# EAGLE design InputChannel (EAGLE 7.3.0)
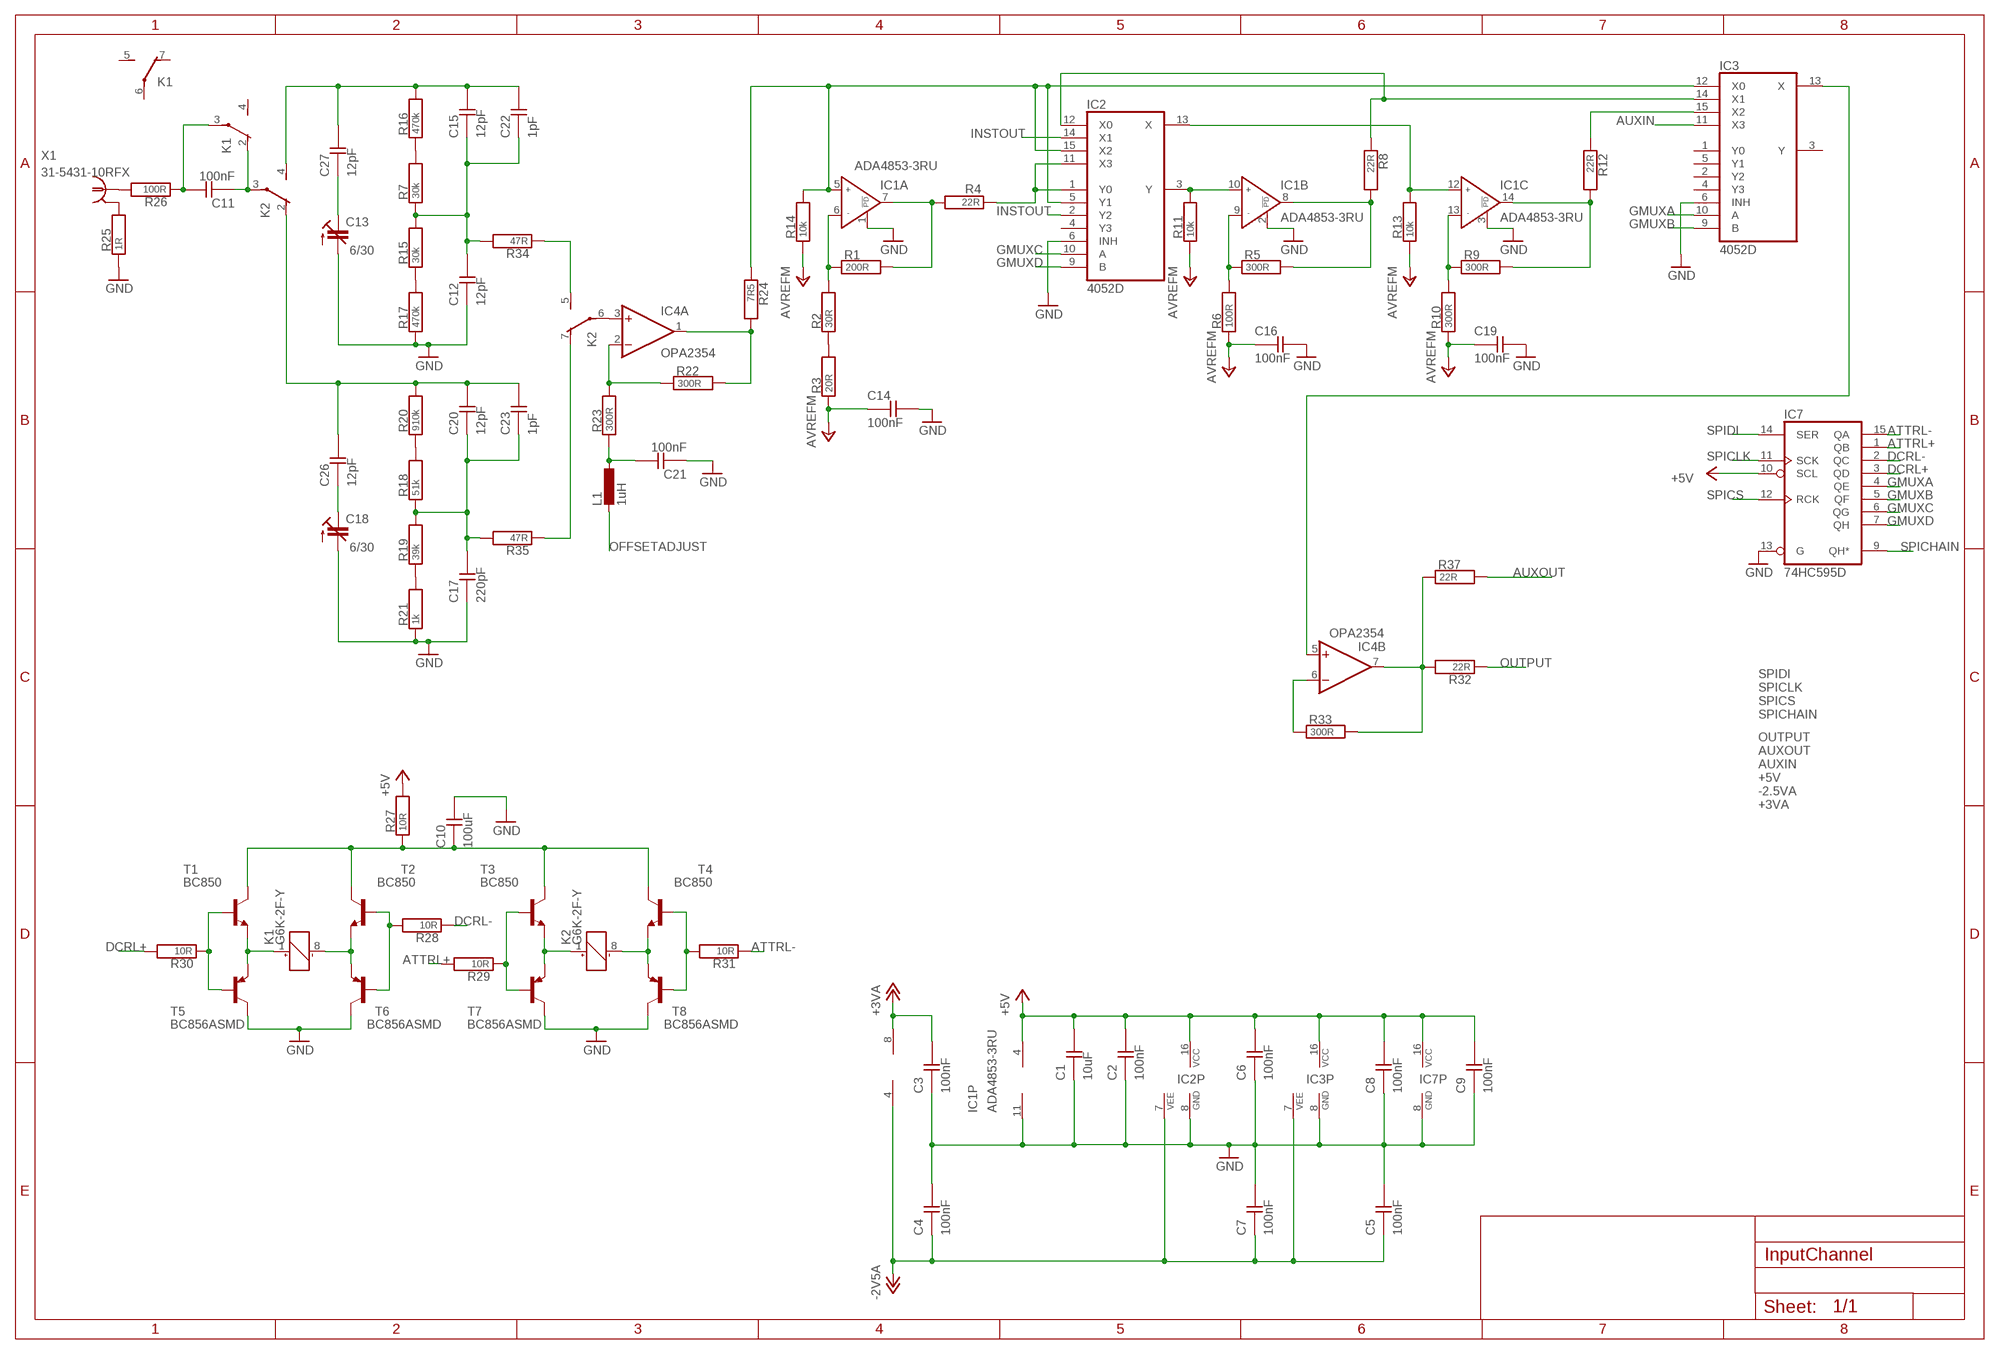
[diagram p0: schematic, sheet 1]

## Parts
C1  10uF  CAPC0603  [0603]
C2  100nF  CAPC0603  [0603]
C3  100nF  CAPC0603  [0603]
C4  100nF  CAPC0402  [0402]
C5  100nF  CAPC0603  [0603]
C6  100nF  CAPC0603  [0603]
C7  100nF  CAPC0603  [0603]
C8  100nF  CAPC0603  [0603]
C9  100nF  CAPC0603  [0603]
C10  100uF  CAPC1206  [1206]
C11  100nF  CAPC0603  [0603]
C12  12pF  CAPC0603  [0603]
C13  6/30  C-TRIMMTZBX4  [CTRIMTZBX4]
C14  100nF  CAPC0402  [0402]
C15  12pF  CAPC0603  [0603]
C16  100nF  CAPC0402  [0402]
C17  220pF  CAPC0603  [0603]
C18  6/30  C-TRIMMTZBX4  [CTRIMTZBX4]
C19  100nF  CAPC0402  [0402]
C20  12pF  CAPC0603  [0603]
C21  100nF  CAPC0402  [0402]
C22  1pF  CAPC0603  [0603]
C23  1pF  CAPC0603  [0603]
C26  12pF  CAPC0603  [0603]
C27  12pF  CAPC0603  [0603]
IC1  ADA4853-3RU  [SO14]
IC2  4052D  [SO16]
IC3  4052D  [SO16]
IC4  OPA2354  AD8682RM  [MSOP08]
IC7  74HC595D  [SO16]
K1  G6K-2F-Y  [G6K-2F-Y]
K2  G6K-2F-Y  [G6K-2F-Y]
L1  1uH  L-EUL3216C  [L3216C]
R1  200R  RESR0603  [0603]
R2  30R  RESR0603  [0603]
R3  20R  RESR0603  [0603]
R4  22R  RESR0603  [0603]
R5  300R  RESR0603  [0603]
R6  100R  RESR0603  [0603]
R7  30k  RESR0603  [0603]
R8  22R  RESR0603  [0603]
R9  300R  RESR0603  [0603]
R10  300R  RESR0603  [0603]
R11  10k  RESR0603  [0603]
R12  22R  RESR0603  [0603]
R13  10k  RESR0603  [0603]
R14  10k  RESR0603  [0603]
R15  30k  RESR0603  [0603]
R16  470k  RESR0603  [0603]
R17  470k  RESR0603  [0603]
R18  51k  RESR0603  [0603]
R19  39k  RESR0603  [0603]
R20  910k  RESR0603  [0603]
R21  1k  RESR0603  [0603]
R22  300R  RESR0603  [0603]
R23  300R  RESR0603  [0603]
R24  7R5  RESR0603  [0603]
R25  1R  RESR0603  [0603]
R26  100R  RESR0603  [0603]
R27  10R  RESR0603  [0603]
R28  10R  RESR0603  [0603]
R29  10R  RESR0603  [0603]
R30  10R  RESR0603  [0603]
R31  10R  RESR0603  [0603]
R32  22R  RESR0603  [0603]
R33  300R  RESR0603  [0603]
R34  47R  RESR0603  [0603]
R35  47R  RESR0603  [0603]
R37  22R  RESR0603  [0603]
T1  BC850  [SOT23]
T2  BC850  [SOT23]
T3  BC850  [SOT23]
T4  BC850  [SOT23]
T5  BC856ASMD  [SOT23-BEC]
T6  BC856ASMD  [SOT23-BEC]
T7  BC856ASMD  [SOT23-BEC]
T8  BC856ASMD  [SOT23-BEC]
X1  31-5431-10RFX  227161-8  [AMP_227161]

## Nets
+3VA: C3.2 IC4.8(P:V+)
+5V: C1.2 C2.2 C6.2 C8.2 C9.2 IC1.4(P:V+) IC2.16(VCC) IC3.16(VCC) IC7.10(SCL) IC7.16(VCC) R27.2
-2V5A: C4.1 C5.1 C7.1 IC2.7(VEE) IC3.7(VEE) IC4.4(P:V-)
ATTRL+: IC7.1(QB) R29.2
ATTRL-: IC7.15(QA) R31.1
AUXIN: IC3.11(X3)
AUXOUT: R37.2
AVREFM: C14.1 C16.1 C19.1 R3.1 R6.1 R10.1 R11.1 R13.1 R14.1
DCRL+: IC7.3(QD) R30.2
DCRL-: IC7.2(QC) R28.1
GMUXA: IC3.10(A) IC7.4(QE)
GMUXB: IC3.9(B) IC7.5(QF)
GMUXC: IC2.10(A) IC7.6(QG)
GMUXD: IC2.9(B) IC7.7(QH)
GND: C1.1 C2.1 C3.1 C4.2 C5.2 C6.1 C7.2 C8.1 C9.1 C10.2 C12.1 C13.2(A) C14.2 C16.2 C17.1 C18.2(A) C19.2 C21.1 IC1.1(A:!POWERDOWN) IC1.2(B:!POWERDOWN) IC1.3(C:!POWERDOWN) IC1.11(P:V-) IC2.6(INH) IC2.8(GND) IC3.6(INH) IC3.8(GND) IC7.8(GND) IC7.13(G) R17.1 R21.1 R25.1 T5.C T6.C T7.C T8.C
INSTOUT: IC2.2(Y2) IC2.14(X1)
N$1: IC1.6(A:IN-) R1.1 R2.2
N$2: IC1.7(A:OUT) R1.2 R4.2
N$3: R2.1 R3.2
N$4: C11.2 K1.3(2:P) R26.1
N$5: IC1.9(B:IN-) R5.1 R6.2
N$6: IC2.1(Y0) IC2.11(X3) R4.1
N$7: C11.1 K1.2(2:O) K2.3(2:P)
N$8: IC2.12(X0) IC3.14(X1) R8.1
N$9: IC1.12(C:IN+) IC2.13(X) R13.2
N$10: IC1.5(A:IN+) IC2.5(Y1) IC2.15(X2) IC3.12(X0) R14.2 R24.1
N$11: R7.2 R16.1
N$12: IC1.13(C:IN-) R9.1 R10.2
N$13: IC1.14(C:OUT) R9.2 R12.2
N$14: IC3.15(X2) R12.1
N$15: IC1.8(B:OUT) R5.2 R8.2
N$16: C12.2 C15.1 C22.1 R7.1 R15.2 R34.2
N$17: IC1.10(B:IN+) IC2.3(Y) R11.2
N$18: R18.2 R20.1
N$19: C17.2 C20.1 C23.1 R18.1 R19.2 R35.2
N$20: R15.1 R17.2
N$21: C15.2 C22.2 C27.2 K2.4(2:S) R16.2
N$23: R19.1 R21.2
N$24: C20.2 C23.2 C26.2 K2.2(2:O) R20.2
N$25: R25.2 X1.2
N$26: IC4.3(A:+IN) K2.6(3:P)
N$27: C21.2 L1.1 R23.1
N$28: IC4.2(A:-IN) R22.1 R23.2
N$29: IC4.1(A:OUT) R22.2 R24.2
N$30: R26.2 X1.1
N$31: K2.5(3:S) R34.1
N$32: IC3.13(X) IC4.5(B:+IN)
N$33: C10.1 R27.1 T1.3(C) T2.3(C) T3.3(C) T4.3(C)
N$34: IC4.7(B:OUT) R32.2 R33.2 R37.1
N$35: K1.8(1:-) T2.2(E) T6.E
N$36: K1.1(1:+) T1.2(E) T5.E
N$37: R30.1 T1.1(B) T5.B
N$38: R28.2 T2.1(B) T6.B
N$39: K2.1(1:+) T3.2(E) T7.E
N$40: K2.8(1:-) T4.2(E) T8.E
N$41: IC4.6(B:-IN) R33.1
N$42: R29.1 T3.1(B) T7.B
N$43: R31.2 T4.1(B) T8.B
N$44: K2.7(3:O) R35.1
N$48: C18.1(E) C26.1
N$49: C13.1(E) C27.1
OFFSETADJUST: L1.2
OUTPUT: R32.1
SPICHAIN: IC7.9(QH*)
SPICLK: IC7.11(SCK)
SPICS: IC7.12(RCK)
SPIDI: IC7.14(SER)
Unconnected: IC2.4(Y3) IC3.1(Y0) IC3.2(Y2) IC3.3(Y) IC3.4(Y3) IC3.5(Y1) K1.4(2:S) K1.5(3:S) K1.6(3:P) K1.7(3:O)

## Notes on the sheet
- SPIDI
  SPICLK
  SPICS
  SPICHAIN
- OUTPUT
  AUXOUT
  AUXIN
  +5V
  -2.5VA
  +3VA

## Library data of the parts
C1-C12 C14-C17 C19-C23 C26 C27 = passive:CAP
C13 C18 = rcl:C-TRIMM: Trimm capacitor
IC1 = teg4:ADA4853-3RU: Low Power, Rail-to-Rail Output, Video Op Amps with Ultralow Power Source: http://www.analog.com/static/imported-files/data_sheets/ADA4853-1_4853-2_4853-3.pdf
IC2 IC3 = 40xx:4052: Dual 4-channel ANALOG MULTIPLEXER
IC4 = linear:AD8682: Dual Low Power, High Speed JFET Operational Amplifiers Source: http://www.analog.com/UploadedFiles/Data_Sheets/AD8682_8684.pdf
IC7 = 74xx-eu:74*595: 8-bit SHIFT REGISTER, output latch
K1 K2 = relay:G6K: Low Signal Relay oeiwcsnts1.omron.com/.. D20G6K0100.pdf; MF: OMRON COMPONENTS USA; MPN: G6K-2F-Y DC3; OC_FARNELL: 1690316; OC_NEWARK: 89C6451
L1 = rcl:L-EU: INDUCTOR, European symbol
R1-R35 R37 = passive:RES
T1-T4 = transistor:BC850: NPN TRANSISTOR
T5-T8 = transistor-pnp:BC856*: PNP Transistror
X1 = connectors:?227161*: JACK, RIGHT ANGLE, 50 OHM, PCB, BNC Source: ENG_CD_5227161_B1.pdf; ALTERNATIVE: LowCost(DX, ebay...); ALTPRICE: 5.6; DIGIKEY: A32260-ND; PRICE: 16

## Board
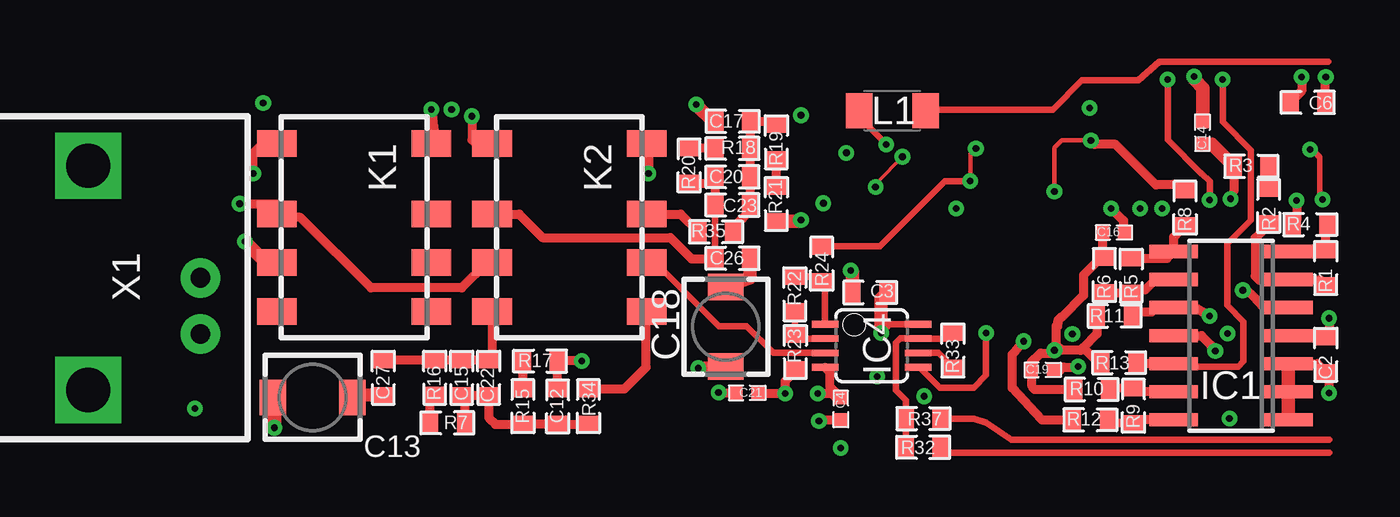
[diagram p1: board, top side]
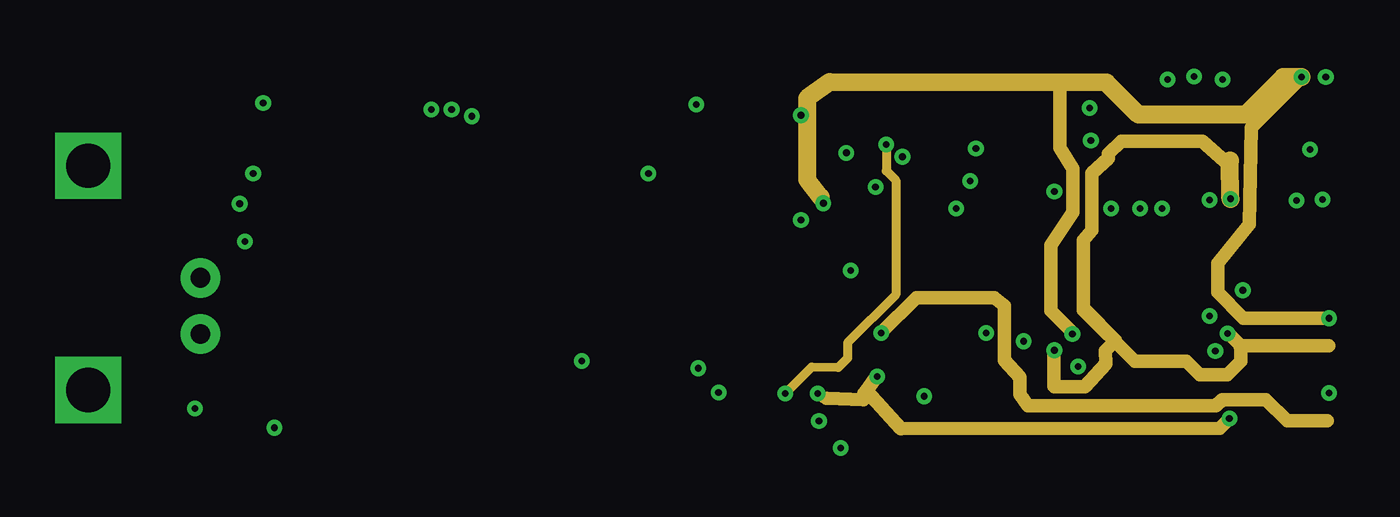
[diagram p2: board, inner layer Route2]
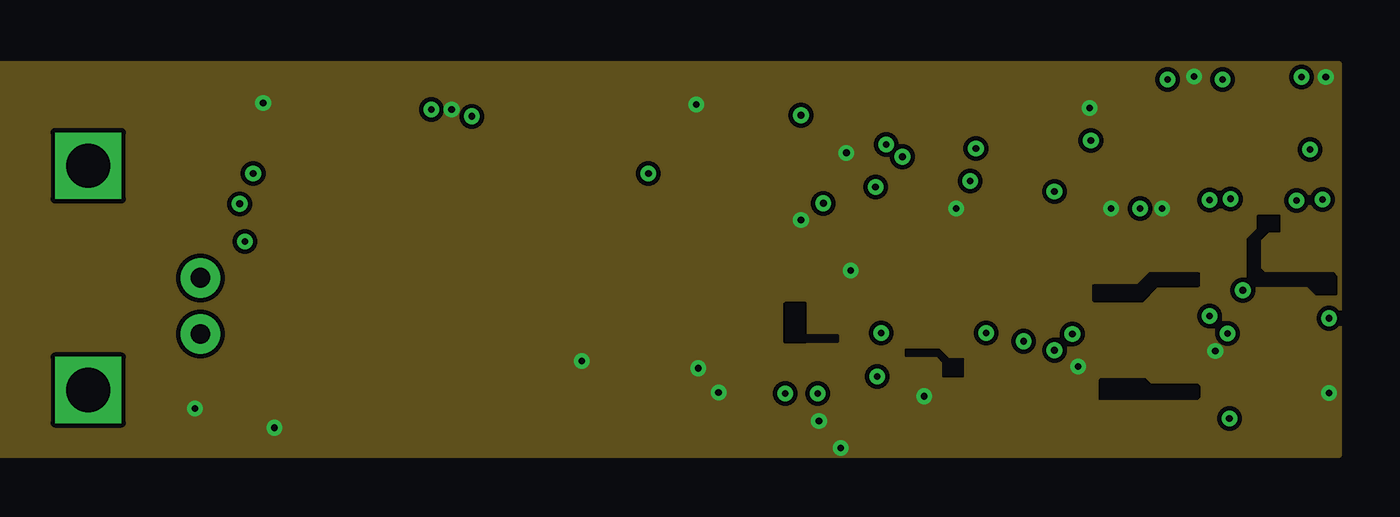
[diagram p3: board, inner layer Route3]
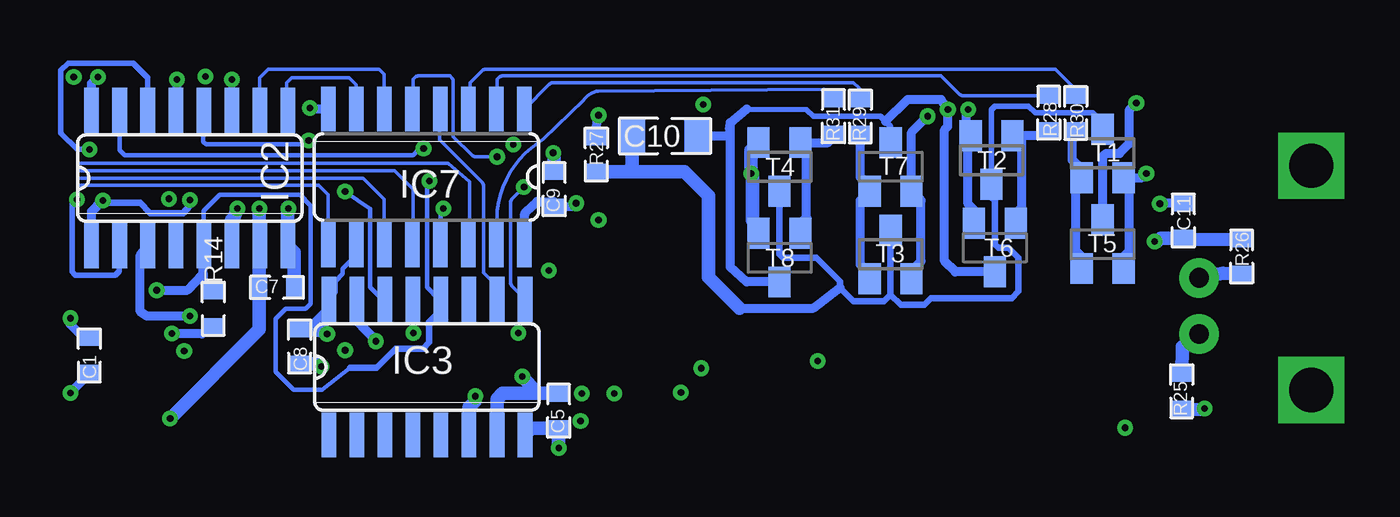
[diagram p4: board, bottom side, seen from below]

No outline drawn. Coordinates in mm, seen from the top.
Copper layers (1+(2*3)+16): Top 0.035mm / dielectric 0.3mm / Route2 0.035mm / dielectric 1mm / Route3 0.035mm / dielectric 0.3mm / Bottom 0.035mm
Design rules "default *": minimum track width 6mil, minimum drill 0.3mm, track to track 6mil, track to pad 6mil, pad to pad 6mil, via to via 6mil, smd to smd 1mil, copper to edge 40mil, drill to drill 8mil, minimum pad ring 10mil, minimum via ring 8mil, stop-mask expansion 4mil, vias tented up to drill 0mil, thermal gap 10mil

### Footprints (pad centres in the part's own frame; a part is rotated, then mirrored left to right if it is on the bottom)
0603 = smd 0.762 x 0.965: 1 -0.787,0; 2 0.787,0
0402 = smd 0.635 x 0.635: 1 -0.498,0; 2 0.523,0
1206 = smd 1.143 x 1.702: 1 -1.473,0; 2 1.473,0
CTRIMTZBX4 = smd 1.6 x 1.2: 1 0,1.8; 2 0,-1.8
SO14 = smd 0.6 x 2.2: 1 -3.81,-2.6; 2 -2.54,-2.6; 3 -1.27,-2.6; 4 0,-2.6; 5 1.27,-2.6; 6 2.54,-2.6; 7 3.81,-2.6; 8 3.81,2.6; 9 2.54,2.6; 10 1.27,2.6; 11 0,2.6; 12 -1.27,2.6; 13 -2.54,2.6; 14 -3.81,2.6
SO16 = smd 0.66 x 2.032: 1 -4.445,-3.073; 2 -3.175,-3.073; 3 -1.905,-3.073; 4 -0.635,-3.073; 5 0.635,-3.073; 6 1.905,-3.073; 7 3.175,-3.073; 8 4.445,-3.073; 9 4.445,3.073; 10 3.175,3.073; 11 1.905,3.073; 12 0.635,3.073; 13 -0.635,3.073; 14 -1.905,3.073; 15 -3.175,3.073; 16 -4.445,3.073
MSOP08 = smd 0.3 x 1.2: 1 -0.976,-2.113; 2 -0.326,-2.113; 3 0.324,-2.113; 4 0.974,-2.113; 5 0.974,2.112; 6 0.324,2.112; 7 -0.326,2.112; 8 -0.976,2.112
G6K-2F-Y = smd 1.2 x 1.8: 1 -3.8,-3.5; 2 -0.6,-3.5; 3 1.6,-3.5; 4 3.8,-3.5; 5 3.8,3.5; 6 1.6,3.5; 7 -0.6,3.5; 8 -3.8,3.5
L3216C = smd 1.2 x 1.6: 1 -1.5,0; 2 1.5,0
SOT23 = smd 1 x 1.4: 1 -0.95,-1.1; 2 0.95,-1.1; 3 0,1.1
SOT23-BEC = smd 1 x 1.4: B -0.95,-1.1; C 0,1.1; E 0.95,-1.1
AMP_227161 = drill 0.9 pad 1.778: 1 0,-5.08; 2 -2.54,-5.08 | drill 2 square: P$1 -5.08,0; P$2 5.08,0

### Placement (x,y rotation side)
C1  62.81,81.53 90 bottom
C2  63.53,81.56 90 top
C3  42.88,84.38 0 top
C4  41.53,79.12 270 top
C5  41.55,79.02 270 bottom
C6  62.71,92.99 180 top
C7  54.33,84.61 0 bottom
C8  53.29,81.94 90 bottom
C9  41.76,89.05 270 bottom
C10  36.75,91.47 0 bottom
C11  13.26,87.63 270 bottom
C12  28.73,79.21 270 top
C13  17.63,79.63 270 top
C14  57.96,91.59 90 top
C15  24.38,80.52 90 top
C16  53.9,87.07 0 top
C17  36.65,92.13 0 top
C18  36.35,82.83 0 top
C19  50.67,80.85 0 top
C20  36.65,89.61 180 top
C21  37.29,79.81 0 top
C22  25.6,80.52 90 top
C23  36.65,88.34 180 top
C26  36.65,85.93 180 top
C27  20.83,80.52 90 top
IC1  59.23,82.42 90 top
IC2  58.27,89.56 0 bottom
IC3  47.52,81 0 bottom
IC4  42.95,81.97 270 top
IC7  47.55,89.61 180 bottom
K1  19.51,87.33 270 top
K2  29.26,87.33 270 top
L1  43.89,92.61 0 top
R1  63.53,85.5 90 top
R2  60.93,88.29 270 top
R3  60.15,90.09 0 top
R4  62.81,87.45 0 top
R5  54.71,85.14 90 top
R6  53.49,85.17 270 top
R7  23.74,78.47 180 top
R8  57.15,88.21 270 top
R9  54.81,79.25 270 top
R10  52.91,79.98 0 top
R11  53.95,83.31 0 top
R12  52.86,78.61 0 top
R13  54.15,81.2 0 top
R14  57.2,83.64 90 bottom
R15  27.15,79.22 270 top
R16  23.16,80.52 90 top
R17  27.94,81.27 180 top
R18  36.65,90.91 180 top
R19  38.63,91.19 90 top
R20  34.69,90.12 270 top
R21  38.63,88.39 90 top
R22  39.47,84.3 90 top
R23  39.5,81.69 90 top
R24  40.69,85.67 270 top
R25  13.34,79.91 90 bottom
R26  10.62,86 270 bottom
R27  39.85,90.63 90 bottom
R28  19.35,92.51 270 bottom
R29  27.89,92.35 90 bottom
R30  18.14,92.51 90 bottom
R31  29.11,92.35 270 bottom
R32  45.29,77.37 180 top
R33  46.63,81.76 90 top
R34  30.12,79.22 270 top
R35  35.89,87.12 0 top
R37  45.29,78.66 0 top
T1  16.92,90.68 0 bottom
T2  21.95,90.37 180 bottom
T3  26.52,86.11 0 bottom
T4  31.55,90.07 180 bottom
T5  16.92,86.56 0 bottom
T6  21.79,86.41 180 bottom
T7  26.52,90.07 0 bottom
T8  31.55,85.95 180 bottom
X1  7.47,85.04 90 top

### Tracks (layer width: path | path; a pad name or v marks a point on that pad's centre or on a via)
+3VA  (via drill 0.3)
  Top 0.305: IC4.8 43.77,82.94 v43.38,82.55
  Top 0.61: v43.38,82.55 43.38,84.1 C3.2
  Route2 0.61: 63.6,78.56 61.77,78.56 60.81,79.53 58.83,79.53 58.55,79.25 50.04,79.25 49.66,79.78 49.66,80.54 48.97,81.31 48.97,83.77 48.51,84.15 44.98,84.15 v43.38,82.55
+5V  (via drill 0.3)
  Top 0.406: v62.43,94.13 62.43,93.5 C6.2 | v63.68,83.21 63.68,82.5 C2.2 61.91,82.35 IC1.4
  Route2 0.406: v40.77,88.42 40.64,88.7
  Route2 0.61: v63.68,83.21 59.79,83.21 58.62,84.38 58.62,85.7 60.07,87.48 60.15,91.85 v62.43,94.13 | 46.41,93.95 46.38,93.98 53.49,93.98 53.59,93.88 53.59,93.9 53.57,93.93 53.49,93.85 51.61,93.85 51.49,93.73 51.49,90.93 52.07,89.99 52.07,88.01 51.08,86.51 51.08,83.54 52.05,82.58 v52.05,82.5 51.99,82.5 | 40.03,93.17 40.03,92.69 v39.75,92.41
  Route2 0.813: v62.43,94.13 61.59,94.13 59.89,92.43 55.04,92.43 53.59,93.88 41.05,93.9 40.03,93.17 40.03,89.48 40.64,88.7
  Bottom 0.203: IC7.10 50.72,86.06 51.33,85.45 51.33,85.22 51.66,84.89 51.66,84.38 IC3.16
  Bottom 0.406: IC7.16 43.1,87.86 arc45 43.03,88.03 42.55,88.49 41.77,88.49 arc45 C9.2 40.92,88.29 v40.77,88.42 | IC2.16 62.71,93.85 v62.43,94.13 | C1.2 63.07,82.32 63.68,82.93 v63.68,83.21 | R27.2 39.83,92.18 v39.75,92.41
  Bottom 0.61: C8.2 53.19,82.83 52.65,82.83 51.97,83.52 IC3.16 51.97,83.31 52.6,82.68 52.22,82.68 v52.05,82.5
-2V5A  (via drill 0.3)
  Top 0.305: C4.1 41.23,79.62 41.05,79.81
  Top 0.406: C4.1 41.07,80.09 41.07,80.76 IC4.4 | v40.51,79.81 41.05,79.81 41.33,79.81 41.35,79.78
  Route2 0.406: 40.89,79.58 40.74,79.58 v40.51,79.81
  Route2 0.61: v59.16,78.66 58.73,78.23 44.27,78.21 42.72,79.93 43.1,80.47 | 40.89,79.58 42.57,79.53 42.8,79.76 42.65,79.76 42.6,79.81 43.1,80.47 | 43.1,80.47 v43.2,80.57
  Bottom 0.61: IC3.7 44.35,79.55 44.09,79.81 C5.1 42.52,79.83 v43.2,80.57 | C7.1 55.12,86.46 IC2.7 | C7.1 v55.12,88.19 | C7.1 55.12,82.7 v59.16,78.66
ATTRL+
  Bottom 0.152: R29.2 27.89,93.47 arc-45 27.96,93.65 28.19,93.88 41.8,93.88 arc-45 41.98,93.8 IC7.1
ATTRL-
  Bottom 0.152: R31.1 29.54,93.57 39.77,93.5 arc-45 40.44,93.09 42.27,91.31 42.52,91.14 arc-45 44.27,88.47 44.35,88.09 44.35,86.6 arc45 IC7.15
AUXOUT
  Top 0.305: 63.68,77.7 49.28,77.7 48.16,78.49 47.57,78.66 R37.2
AVREFM  (via drill 0.3)
  Top 0.406: 51.38,82.93 51.38,83.06 51.41,83.13 51.54,83.26 51.56,83.26 52.55,84.25 52.55,85.17 53.34,85.95 R6.1 53.4,86.05 C16.1 | 51.38,82.83 51.38,82.93 | 51.38,82.93 51.31,82.86 51.31,81.81 51.41,81.71 51.28,81.71 v51.23,81.76 | 51.38,81.76 51.46,81.86 51.33,81.86 v51.23,81.76 | R11.1 53.16,82.5 52.54,81.88 | 52.54,81.88 52.43,81.76 51.38,81.76 | 51.38,81.76 v51.23,81.76 | R13.1 53.21,81.2 52.54,81.88 | R3.1 59.36,89 v59.21,88.62 | v51.23,81.76 51.1,81.64 50.6,81.64 50.17,81.21 C19.1 50.22,80.81 50.22,80.11 50.34,79.98 R10.1
  Top 0.61: C14.1 58.36,91.09 R3.1
  Route2 0.61: v59.08,82.53 59.11,82.53 59.66,81.97 | 59.66,81.97 59.66,81.25 59.05,80.64 57.81,80.64 57.2,81.25 54.86,81.25 52.55,83.57 | 52.55,83.57 52.55,86.74 52.93,87.2 52.93,89.79 53.67,90.45 53.67,90.65 54.25,91.24 57.94,91.24 58.95,90.32 59.18,90.32 | 52.55,83.57 52.65,83.57 54,82.22 53.54,81.74 53.57,81.15 52.6,80.11 51.23,80.11 51.21,80.14 51.21,81.74 v51.23,81.76 | 59.66,81.97 63.65,81.97 | 59.64,81.97 59.66,81.97
  Route2 0.813: v59.21,88.62 59.18,90.32 59.18,90.35
  Bottom 0.406: v51.23,81.76 51.16,81.69 | R14.1 57.38,82.86 57.71,82.5 59,82.5 v59.08,82.53
DCRL+
  Bottom 0.152: R30.2 18.14,93.47 arc-45 18.21,93.65 19.05,94.49 44.85,94.49 arc-45 45.03,94.41 45.57,93.88 45.57,92.87 arc45 IC7.3
DCRL-
  Bottom 0.152: R28.1 23.24,93.29 arc45 23.42,93.37 24.23,94.18 44.09,94.18 arc-45 44.27,94.11 44.35,94.03 44.35,92.75 arc45 IC7.2
GMUXA
  Bottom 0.152: IC7.4 arc-45 46.94,92.62 46.94,91.29 45.03,89.38 arc45 44.96,89.2 44.96,85.27 44.58,84.89 44.58,84.3 IC3.10
GMUXB  (via drill 0.3)
  Top 0.152: v43.13,89.15 43.13,89.2 arc-45 43.2,89.38 v44.35,90.53
  Bottom 0.152: v43.13,89.15 43.66,88.62 arc-45 43.74,88.44 43.74,84.87 arc-45 43.65,84.64 IC3.9 | v44.35,90.53 45.31,90.53 arc45 45.49,90.6 46.33,91.44 46.33,93.93 arc-45 46.4,94.11 46.48,94.18 47.9,94.18 arc-45 48.08,94.11 48.16,94.03 48.16,92.75 arc45 IC7.5
GMUXC
  Bottom 0.152: IC7.6 49.45,94.26 49.68,94.49 54.71,94.49 55.09,94.11 IC2.10
GMUXD
  Bottom 0.152: IC7.7 50.72,93.78 51.05,94.11 53.65,94.11 53.87,93.88 53.87,92.69 IC2.9
GND  (via drill 0.3)
  Top 0.203: v46.79,88.19 46.69,88.19 46.66,88.21
  Top 0.406: v15.39,92.96 15.24,92.96 | v53.8,88.19 54.36,87.63 54.36,87.14 C16.2 | C6.1 63.5,94.11 v63.52,94.13 | v63.68,79.83 63.68,80.62 C2.1 63.14,81.15 IC1.3 | IC1.11 57.89,82.42 58.32,81.99 58.32,81.94 v58.52,81.74 | 57.58,94 57.58,94.16 v57.56,94.16 | C21.1 36.07,79.81 v36.02,79.86 | C4.2 40.6,78.6 v40.56,78.56 | C12.1 R17.1 v29.82,81.28 | C19.2 51.49,80.85 51.64,81 52.27,81 v52.3,81.03
  Top 0.61: IC1.3 IC1.2 IC1.1 | C13.2 15.9,79.05 v15.9,78.26 | C14.2 57.96,93.62 57.58,94 | C17.1 35.76,92.13 v35,92.89 | R21.1 39.7,87.61 v39.75,87.66 | C18.2 36.1,80.95 v35.1,80.95 | C3.1 42.09,85.29 v42.01,85.37
  Bottom 0.203: IC7.13 46.91,88.06 v46.79,88.19
  Bottom 0.254: 33.05,92.69 30.33,92.66 30.02,92.35 26.98,92.35 26.75,92.13 26.52,91.9 T7.C
  Bottom 0.406: T5.C 16.92,90.53 16.76,90.68 16.15,90.68 15.7,91.14 15.7,92.66 v15.39,92.96 | T8.C 33.04,84.85 33.78,85.52 33.78,91.57 | 33.78,91.57 33.78,92.08 | 33.78,92.08 33.05,92.69 | T6.C 23.59,85.31 24.08,85.8 24.08,91.75 23.93,91.9 v23.93,92.66 24.23,93.12 25.76,93.12 26.75,92.13 | 33.81,91.75 33.78,92.08 | IC7.8 52.78,92.69 v52.83,92.73 | v63.52,94.13 63.48,94.18 | C1.1 62.81,80.7 v63.68,79.83 | v58.52,81.74 58.52,81.71 58.57,81.66 | C10.2 33.88,91.47 33.78,91.57
  Bottom 0.61: IC3.8 42.77,78.23 C5.2 v41.55,77.34 | IC3.6 45.62,79.17 45.34,79.45 v45.34,79.68 | C7.2 53.54,86.21 IC2.8 53.82,88.24 v53.8,88.19 | IC2.6 56.36,87.68 56.31,87.73 56.29,87.73 v56.11,88.19 | C8.1 52.6,81.15 52.53,81.08 v52.3,81.03 | C9.1 41.76,90.65 v41.81,90.7 | R25.1 12.32,79.07 v12.29,79.12
  pour Route3 (isolate 0.203): 0.2,94.77 64.14,94.77 64.16,94.74 64.16,77.01 64.14,76.99 0.23,76.99 0.18,77.04 0.18,94.74
INSTOUT  (via drill 0.3)
  Top 0.254: v62.81,90.86 63.07,90.68 63.25,90.5 63.25,88.72 v63.37,88.59
  Bottom 0.254: IC2.14 60.17,94.11 60.83,94.77 63.78,94.77 64.11,94.44 64.11,91.62 64.08,91.59 64.08,91.57 63.37,90.86 v62.81,90.86 | v63.37,88.59 63.6,88.37 63.6,85.32 63.45,85.17 61.65,85.17 61.47,85.34 61.47,86.46 IC2.2
N$1
  Top 0.406: R1.1 63.27,84.96 IC1.6 61.81,84.94 60.5,84.94 60.33,85.11 60.33,86.84 60.71,87.22 R2.2
N$2
  Top 0.406: IC1.7 63.48,86.23 R1.2 63.52,87.38 R4.2
N$3
  Top 0.406: R2.1 R3.2
N$4  (via drill 0.3)
  Top 0.61: K1.3 15.52,85.72 v14.55,86.69
  Bottom 0.61: R26.1 13.18,86.77 C11.2 14.28,86.84 14.43,86.69 v14.55,86.69
N$5
  Top 0.406: IC1.9 55.8,84.96 55.32,84.48 54.84,84.48 R5.1 53.52,84.35 R6.2
N$6  (via drill 0.3)
  Top 0.305: v56.36,94.03 56.36,91.29 57.86,89.79 57.89,89.79 58.27,89.41 v58.27,88.57
  Top 0.406: v62.2,88.54 62.2,87.63 R4.1
  Bottom 0.305: IC2.11 v56.36,94.03 | v58.27,88.57 58.27,88.32 58.57,87.96 60.07,87.96 60.5,88.44 62.1,88.44 v62.2,88.54
  Bottom 0.406: IC2.1 62.71,88.04 v62.2,88.54
N$7  (via drill 0.3)
  Top 0.406: v14.33,88.39 16.01,88.39 K1.2 16.15,87.78 17.07,87.78 20.27,84.58 24.38,84.58 25.53,85.72 K2.3
  Bottom 0.406: C11.1 14.17,88.42 v14.33,88.39
N$8  (via drill 0.3)
  Top 0.203: v51.23,88.95 51.23,90.93 51.56,91.26 v52.88,91.26
  Top 0.406: R8.1 57.17,89 56.92,89.26 55.83,89.26 54,91.08 53.06,91.08 v52.88,91.26
  Bottom 0.203: IC3.14 49.55,84.07 50.09,84.61 50.09,88.16 v51.23,88.95 | v52.88,91.26 52.93,91.26 53.11,91.08 57.53,91.08 57.66,91.21 57.66,92.61 IC2.12
N$9  (via drill 0.3)
  Top 0.305: v58.85,94.03 58.85,92.1 60.12,90.83 60.12,87.66 59.05,86.59 59.05,83.8 59.79,83.06 59.79,81.25 59.56,81.03 57.66,81.03 57.53,81.15
  Top 0.406: R13.2 54.99,81.15 IC1.12 57.53,81.15
  Bottom 0.406: v58.85,94.03 58.83,92.71 IC2.13
N$10  (via drill 0.3)
  Top 0.203: v47.42,89.43 47.42,90.65 v47.68,90.91
  Top 0.305: R24.1 43.33,86.46 46.28,89.41 47.4,89.41 v47.42,89.43
  Top 0.406: IC1.5 60.71,83.69 60.27,84.18 59.94,84.48 v59.77,84.48
  Bottom 0.203: IC3.12 46.99,84.07 47.52,84.61 47.52,89.33 v47.42,89.43 | v47.68,90.91 47.85,90.91 48.16,90.6 61.21,90.6 61.44,90.83 IC2.15 | IC2.5 57.63,88.09 56.92,88.8 53.26,88.8 52.78,88.32 52.78,83.87 53.01,83.64 53.92,83.64 54.38,83.19 54.38,80.8 53.57,79.98 52.27,79.98 51,80.97
  Bottom 0.305: 51,80.97 49.81,80.97 48.95,81.84 47.7,81.84 47.42,82.12 47.42,83.06 47.14,83.34 47.07,83.34 46.91,83.49 46.91,84.05 IC3.12
  Bottom 0.406: v59.77,84.48 58.37,84.48 57.66,85.22 | 57.66,85.22 57.66,86.46 IC2.5 | 57.66,85.22 57.66,84.89 R14.2
N$11
  Top 0.406: R7.2 22.95,79.53 R16.1
  Top 0.61: 23.23,79.66 R16.1
N$12
  Top 0.406: IC1.13 54.97,79.88 R9.1 53.75,80.03 R10.2
N$13
  Top 0.406: IC1.14 54.97,78.61 R9.2 53.8,78.46 R12.2
N$14  (via drill 0.3)
  Top 0.406: R12.1 50.67,78.61 49.33,80.06 49.33,81.56 v49.84,82.17
  Bottom 0.406: IC3.15 50.7,83.11 v49.84,82.17
N$15
  Top 0.406: R5.2 56.33,85.93 IC1.8 56.63,86.88 R8.2
N$16
  Top 0.406: R7.1 24.53,79.58 C15.1 C22.1 25.6,78.72 25.91,78.41 27.13,78.41 R15.2 28.71,78.44 C12.2 30.11,78.42 R34.2
N$17  (via drill 0.3)
  Top 0.406: R11.2 54.91,83.49 55.63,83.49 55.83,83.69 IC1.10 57.63,83.69 v58.27,83.31
  Bottom 0.406: v58.27,83.31 60.2,83.31 60.5,83.52 60.5,86.08 IC2.3
N$18
  Top 0.406: R18.2 R20.1
N$19
  Top 0.406: R19.2 38.48,92.13 C17.2 R18.1 C20.1 C23.1 37.44,88.11 37.11,87.73 36.68,87.3 R35.2
N$20
  Top 0.406: R15.1 R17.2
N$21
  Top 0.406: K2.4 25.76,81.46 C22.2 C15.2 R16.2 | R16.2 C27.2
  Top 0.61: R16.2 | C15.2
N$22
  cutout Top: 46.15,81.23 47.09,80.57 47.14,81.36
N$23
  Top 0.406: R21.2 R19.1
N$24
  Top 0.305: C23.2 C26.2
  Top 0.406: K2.2 26.98,87.92 28.04,86.87 33.83,86.87 34.8,85.9 35.84,85.9 C26.2 | R20.2 35.59,89.33 C20.2 C23.2
N$25
  Bottom 0.61: R25.2 13.31,81.92 X1.2
N$26
  Top 0.305: 33.17,85.72 36.04,82.86 37.29,82.86 38.5,81.64 IC4.3
  Top 0.61: K2.6 33.17,85.72
N$27  (via drill 0.3)
  Top 0.305: L1.1 42.39,92.31 v43.61,91.08
  Top 0.406: R23.1 39.04,80.37 v39.04,79.81 C21.2
  Route2 0.406: v43.61,91.08 43.61,89.89 44.04,89.46 44.04,84.28 41.86,82.09 41.86,81.41 41.43,80.97 40.23,81 v39.04,79.81
N$28
  Top 0.305: IC4.2 39.5,82.29 R23.2 39.47,82.32 R22.1
N$29
  Top 0.305: IC4.1 40.84,84.74 R24.2 40.66,84.91 40.51,84.91 40.34,85.09 R22.2
N$30
  Bottom 0.61: X1.1 11.48,85.24 R26.2
N$31
  Top 0.406: R34.1 31.75,80.01 32.74,81 32.74,83.5 K2.5
N$32  (via drill 0.3)
  Top 0.305: IC4.5 45.12,80.99 46.05,80.06 47.57,80.06 48.13,80.62 v48.13,82.55
  Bottom 0.254: IC3.13 48.16,82.65 v48.13,82.55
N$33
  Bottom 0.254: T1.3 16.92,92.05 17.37,92.51 19.96,92.51 20.27,92.81 21.79,92.81 21.95,92.66 T2.3
  Bottom 0.305: T4.3 31.55,86.11 31.39,85.95 29.87,85.95 28.8,84.89 28.8,84.58 28.19,83.97 26.82,83.97 26.52,84.28 | 26.52,84.28 T3.3 | T2.3 21.95,88.7 21.79,88.54 21.79,86.56 21.64,86.41 21.18,86.41 20.73,85.95 20.73,84.43 21.03,84.12 24.69,84.12 24.99,83.82 26.06,83.82 26.52,84.28
  Bottom 0.406: 33.38,83.67 30.02,83.67 28.8,84.58
  Bottom 0.61: R27.1 38.46,89.84 | 38.46,89.84 35.87,89.84 34.77,88.75 34.77,85.06 33.38,83.67 | C10.1 38.23,90.07 38.46,89.84
N$34
  Top 0.305: R33.2 46.38,82.29 IC4.7 44.25,82.3 44.04,82.09 44.04,79.96 44.5,79.5 R37.1 R32.2
N$35  (via drill 0.3)
  Top 0.406: v23.01,92.66 23.17,91.29 K1.8
  Bottom 0.406: T6.E 22.74,88.12 23.01,88.39 23.01,91.51 | 23.01,91.51 T2.2 | 23.01,91.51 23.1,91.97 23.1,92.58 v23.01,92.66
N$36  (via drill 0.3)
  Top 0.406: v14.94,89.76 14.94,90.68 15.39,91.14 16,91.14 K1.1
  Bottom 0.406: T5.E 15.97,85.99 15.7,86.26 15.7,89.31 T1.2 15.12,89.58 v14.94,89.76
N$37
  Bottom 0.406: T5.B 17.87,85.99 18.14,86.26 18.14,89.31 T1.1 17.87,89.95 18.29,90.37 18.29,91.57 R30.1
N$38
  Bottom 0.406: T6.B 20.84,87.97 20.57,88.24 20.57,91.51 | 20.57,91.51 T2.1 | 20.57,91.51 19.57,91.51 R28.2
N$39  (via drill 0.3)
  Top 0.406: v24.84,92.35 24.84,91.29 25.15,90.98 25.62,90.98 K2.1
  Bottom 0.406: T3.2 25.57,85.38 25.15,85.8 25.15,88.55 T7.E 25.57,91.63 v24.84,92.35
N$40  (via drill 0.3)
  Top 0.61: K2.8 32.76,89.84 v32.84,89.76
  Bottom 0.61: T4.2 32.84,90.82 v32.84,89.76 32.77,89.69 32.77,87.66 32.5,87.39 T8.E
N$41
  Top 0.305: IC4.6 45.97,81.64 R33.1
N$42
  Bottom 0.406: T3.1 27.47,85.23 27.89,85.65 27.89,88.55 T7.B 27.47,89.19 27.89,89.61 R29.1
N$43
  Bottom 0.406: R31.2 29.36,91.17 T4.1 30.33,90.9 30.33,87.78 30.6,87.51 T8.B
N$44
  Top 0.406: K2.7 34.3,87.92 R35.1
N$45
  cutout Route3: 46.18,80.57 47.12,80.57 47.14,80.59 47.14,81.36 47.12,81.38 46.46,81.38 46.02,81.81 44.48,81.81 44.45,81.79 44.45,81.51 44.48,81.48 45.9,81.48 46.15,81.23 46.15,80.59
N$46
  cutout Route3: 40.01,82.12 41.43,82.12 41.48,82.17 41.48,82.42 41.43,82.47 40.03,82.47 40.01,82.5 40.01,83.9 39.95,83.95 39.04,83.95 38.96,83.87 38.96,82.14 39.01,82.09 39.98,82.09
N$48
  Top 0.61: C26.1 37.44,85.04 C18.1
N$49
  Top 0.61: C27.1 19.63,79.76 C13.1
N$54
  cutout Route3: 60.48,87.91 61.42,87.91 61.44,87.88 61.44,87.12 61.42,87.1 60.91,87.1 60.55,86.74 60.55,85.47 60.73,85.29 63.86,85.29 64.03,85.12 64.03,84.3 63.98,84.25 63.09,84.25 62.71,84.63 60.5,84.63 59.97,85.17 59.97,86.82 60.43,87.27 60.43,87.86
N$55
  cutout Route3: 53.01,84.76 55.02,84.76 55.55,85.29 57.76,85.29 57.78,85.27 57.78,84.66 57.73,84.61 55.88,84.61 55.22,83.95 53.04,83.95 52.98,84 52.98,84.73
N$56
  cutout Route3: 53.34,80.49 55.32,80.49 55.58,80.24 57.71,80.24 57.81,80.14 57.81,79.63 57.71,79.53 53.26,79.53 53.26,80.42
OFFSETADJUST
  Top 0.305: 63.63,94.82 55.98,94.82 55.04,93.98 52.48,93.98 51.16,92.66 45.41,92.66 45.39,92.64 L1.2
OUTPUT
  Top 0.305: R32.1 46.2,77.22 46.53,77.11 63.68,77.11
SPICHAIN
  Bottom 0.152: IC7.9 51.99,88.8 52.43,89.23 63.32,89.23
SPICLK
  Bottom 0.152: IC7.11 49.45,88.59 50.42,89.56 63.3,89.56
SPICS
  Bottom 0.152: IC7.12 48.16,86.56 48.16,89.05 49,89.89 63.3,89.89
SPIDI
  Bottom 0.152: 45.59,86.49 45.59,89.38 46.56,90.22 63.27,90.22 | 45.59,86.44 45.59,86.49 | 45.59,86.49 IC7.14